# Altium schematic sheet MDBT42Q - Copy (3).SchDoc
size A3
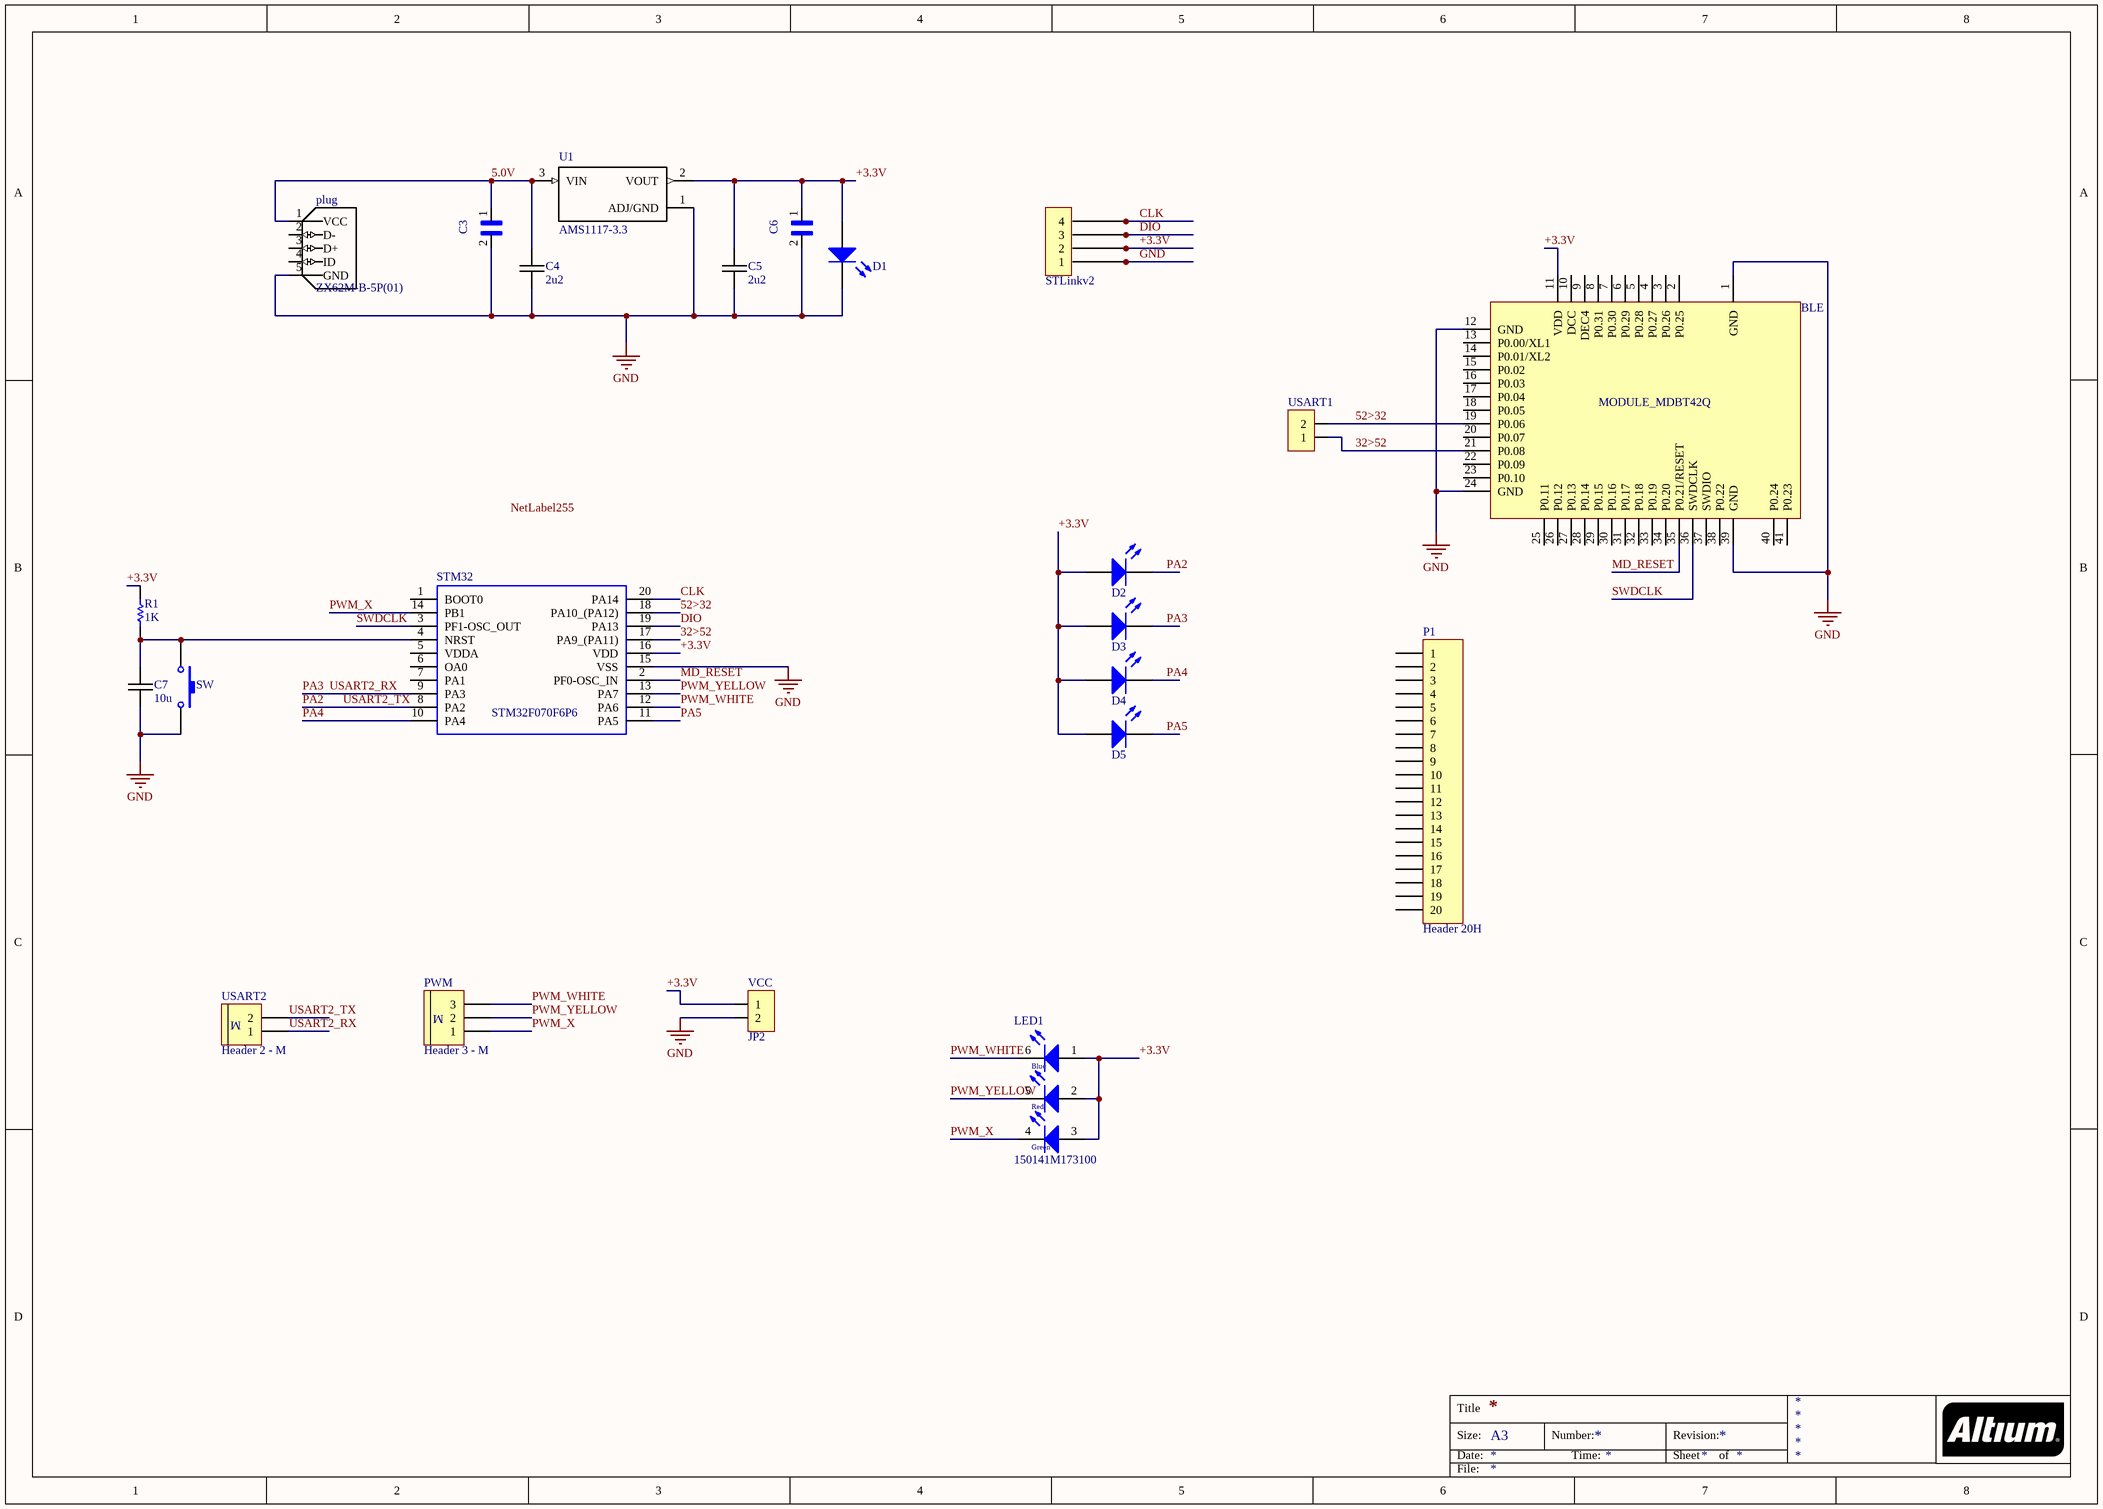
[diagram p0: MDBT42Q - Copy (3).SchDoc]

## Parts
BLE  MODULE_MDBT42Q  [PCB_MDBT42Q_10X16]
C3  C3216X5R1A106K160AB  [CAPC3216X180]  (value not drawn)
C4  2u2  [0805C-GENERIC]
C5  2u2  [0805C-GENERIC]
C6  C3216X5R1A106K160AB  [CAPC3216X180]  (value not drawn)
C7  10u  [0805C-GENERIC]
D1  LED SMD  [LED_0805_Blue]  (value not drawn)
D2  LED SMD  [LED_0805_Blue]  (value not drawn)
D3  LED SMD  [LED_0805_Blue]  (value not drawn)
D4  LED SMD  [LED_0805_Blue]  (value not drawn)
D5  LED SMD  [LED_0805_Blue]  (value not drawn)
LED1  150141M173100  [LED RGB 5050]
P1  Header 20H  [HDR1X20H]
plug  ZX62M-B-5P(01)  [HRS_ZX62M-B-5P(01)]
PWM  Header 3 - M  [Medium - Header 3]
R1  value 1K  [RES-SM-1206]  (hidden comment: RESISTOR SMD)
STLinkv2  JP  [Jumper 4x1]  (value not drawn)
STM32  STM32F070F6P6  [SOP65P640X120-20N]
SW  SW  [SW2]  (value not drawn)
U1  AMS1117-3.3  [SOT229P700X180-4N]
USART1  (no value)  [JP2-D1T]
USART2  Header 2 - M  [Medium - Header 2]
VCC  JP2  [JP2-D1T]

## Nets
GND: BLE.1(GND) BLE.12(GND) BLE.24(GND) BLE.39(GND) C3.2 C4.2 C5.2 C6.2 C7.2 D1.2(K) plug.5(GND) STLinkv2.1 STM32.15(VSS) SW.2 U1.1(ADJ/GND) VCC.2
5.0V: C3.1 C4.1 plug.1(VCC) U1.3(VIN)
32>52: BLE.21(P0.08) STM32.17(PA9_(PA11)) USART1.1
52>32: BLE.19(P0.06) STM32.18(PA10_(PA12)) USART1.2
+3.3V: BLE.11(VDD) C5.1 C6.1 D1.1(A) D2.1(A) D3.1(A) D4.1(A) D5.1(A) LED1.1 LED1.2 LED1.3 R1.2 STLinkv2.2 STM32.16(VDD) U1.2(VOUT) VCC.1
CLK: STLinkv2.4 STM32.20(PA14)
DIO: STLinkv2.3 STM32.19(PA13)
MD_RESET: BLE.35(P0.21/RESET) STM32.2(PF0-OSC_IN)
PA2: D2.2(K) STM32.8(PA2) USART2.2  [also labelled USART2_TX]
PA3: D3.2(K) STM32.9(PA3) USART2.1  [also labelled USART2_RX]
PA4: D4.2(K) STM32.10(PA4)
PA5: D5.2(K) STM32.11(PA5)
PWM_WHITE: LED1.6 PWM.3 STM32.12(PA6)
PWM_X: LED1.4 PWM.1 STM32.14(PB1)
PWM_YELLOW: LED1.5 PWM.2 STM32.13(PA7)
SWDCLK: BLE.36(SWDCLK) STM32.3(PF1-OSC_OUT)
NetC7_1: C7.1 R1.1 STM32.4(NRST) SW.1

Not connected (* = marked no-connect by the designer): BLE 2(P0.25) 3(P0.26) 4(P0.27) 5(P0.28) 6(P0.29) 7(P0.30) 8(P0.31) 9(DEC4) 10(DCC) 13(P0.00/XL1) 14(P0.01/XL2) 15(P0.02) 16(P0.03) 17(P0.04) 18(P0.05) 20(P0.07) 22(P0.09) 23(P0.10) 25(P0.11) 26(P0.12) 27(P0.13) 28(P0.14) 29(P0.15) 30(P0.16) 31(P0.17) 32(P0.18) 33(P0.19) 34(P0.20) 37(SWDIO) 38(P0.22) 40(P0.24) 41(P0.23); P1 1 2 3 4 5 6 7 8 9 10 11 12 13 14 15 16 17 18 19 20; plug 2(D-) 3(D+) 4(ID); STM32 1(BOOT0) 5(VDDA) 6(OA0) 7(PA1)

## Notes on the sheet
- Labels drawn without touching a wire or pin: NetLabel255
- Title
- Size:
- Date:
- A3
- Number:
- Time:
- Revision:
- Sheet
- of
- File:
- (in symbol Header 2 - M) M
- (in symbol Header 3 - M) M
- (in symbol LED RGB 5050) Blue; Red; Green

## Library data of the parts
BLE = MODULE_MDBT42Q: MDBT42Q
C3 C6 = C3216X5R1A106K160AB: C Series 1206 10 uF 10 V Â±10 % Tolerance X5R SMT Multilayer Ceramic Capacitor; MF: TDK; SnapEDA_Link: https://www.snapeda.com/parts/C3216X5R1A106K160AB/TDK/view-part/?ref=snap; Availability: Unavailable; Price: 0.19 USD; Package: 1206 TDK; MP: C3216X5R1A106K160AB; Value: *
C4 C5 C7 = 0805C-2U2-6V3-X5R-PAN: CAPACITOR 0805 CERAMIC; Manufacturer Part Number: ECJ-1VB0J225K; Manufacturer: Panasonic - ECG; Reel: C7; Supplier 1: Digi-Key; Supplier Part Number 1: PCC2273TR-ND
D1-D5 = LED SMD: LED
LED1 = LED RGB 5050: Manufacturer: Würth Elektronik eiSos GmbH; Color: Red & Green & Blue; PartNo: 150141M173100; ComponentLink1Description: Manufacturer; ComponentLink1URL: http://www.we-online.de; Created by: Christin Otto; Created Date: June 2013; ComponentLink2Description: Datasheet; ComponentLink2URL: http://katalog.we-online.com/led/datasheet/150141M173100.pdf
P1 = Header 20H: Header, 20-Pin, Right Angle; LatestRevisionDate: 17-Jul-2002; LatestRevisionNote: Re-released for DXP Platform.; Publisher: Altium Limited
plug = ZX62M-B-5P(01): Conn Rcpt Micro Usb b Mid Mnt; MF: Hirose; Availability: Unavailable; Price: None; SnapEDA_Link: https://www.snapeda.com/parts/ZX62M-B-5P/Hirose%20Electric%20Co%20Ltd/view-part/?ref=snap; MP: ZX62M-B-5P; Package: None; Value: *
PWM = Header 3 - M: Header, 3-Pin, Medium; LatestRevisionDate: 17-Jul-2002; LatestRevisionNote: Re-released for DXP Platform.; Publisher: Altium Limited
R1 = RESISTOR SMD: Resistor
STLinkv2 = Jumper 4x1
STM32 = STM32F070F6P6: STMICROELECTRONICS - STM32F070F6P6 - MCU, 32BIT, CORTEX-M0, 48MHZ, TSSOP-20; Geometry.Height: 1.2mm; Manufacturer_Name: STMicroelectronics; Manufacturer_Part_Number: STM32F070F6P6; RS Part Number: *; RS Price/Stock: *; Arrow Part Number: STM32F070F6P6; Arrow Price/Stock: https://www.arrow.com/en/products/stm32f070f6p6/stmicroelectronics; Datasheet Link: http://www.st.com/content/ccc/resource/technical/document/datasheet/31/4f/10/5f/a5/32/46/42/DM00141386.pdf/files/DM00141386.pdf/jcr:content/translations/en.DM00141386.pdf
SW = Tact SW - 2Pin: Switch button 2 pin
U1 = AMS1117-3.3: Sot223/Pkg 1-Amp 3.3-Volt Low Drop Out Voltage Regulatator; MF: Advanced Monolithic Systems; SnapEDA_Link: https://www.snapeda.com/parts/AMS1117-3.3/Advanced%20Monolithic%20Systems/view-part/?ref=snap; Availability: Unavailable; MP: AMS1117-3.3; Price: None; Package: None; Value: *
USART1 VCC = JP2: WR-PHD 2.54 mm Angled Socket Header; Manufacturer: W¨¹rth Elektronik eiSos GmbH; partNo: 613002143121; ComponentLink1 Description: Manufacturer; ComponentLink2 Description: Datasheet; NoPins: 02; Created Date: 29 March 2013; ComponentLink1URL: http://www.we-online.com; ComponentLink2URL: http://katalog.we-online.de/em/datasheet/6130xx143121.pdf; Created by: Karrer Zheng
USART2 = Header 2 - M: Header, 2-Pin, Medium; LatestRevisionDate: 17-Jul-2002; LatestRevisionNote: Re-released for DXP Platform.; Publisher: Altium Limited